# EAGLE schematic vcan_v5 (EAGLE 9.7.0)
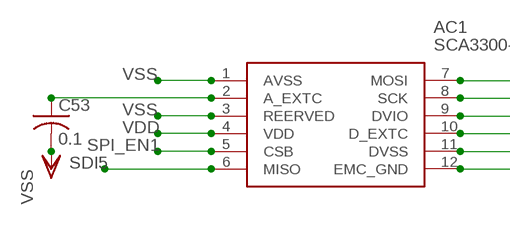
[diagram p0: schematic, sheet 1, part 1 of 2]
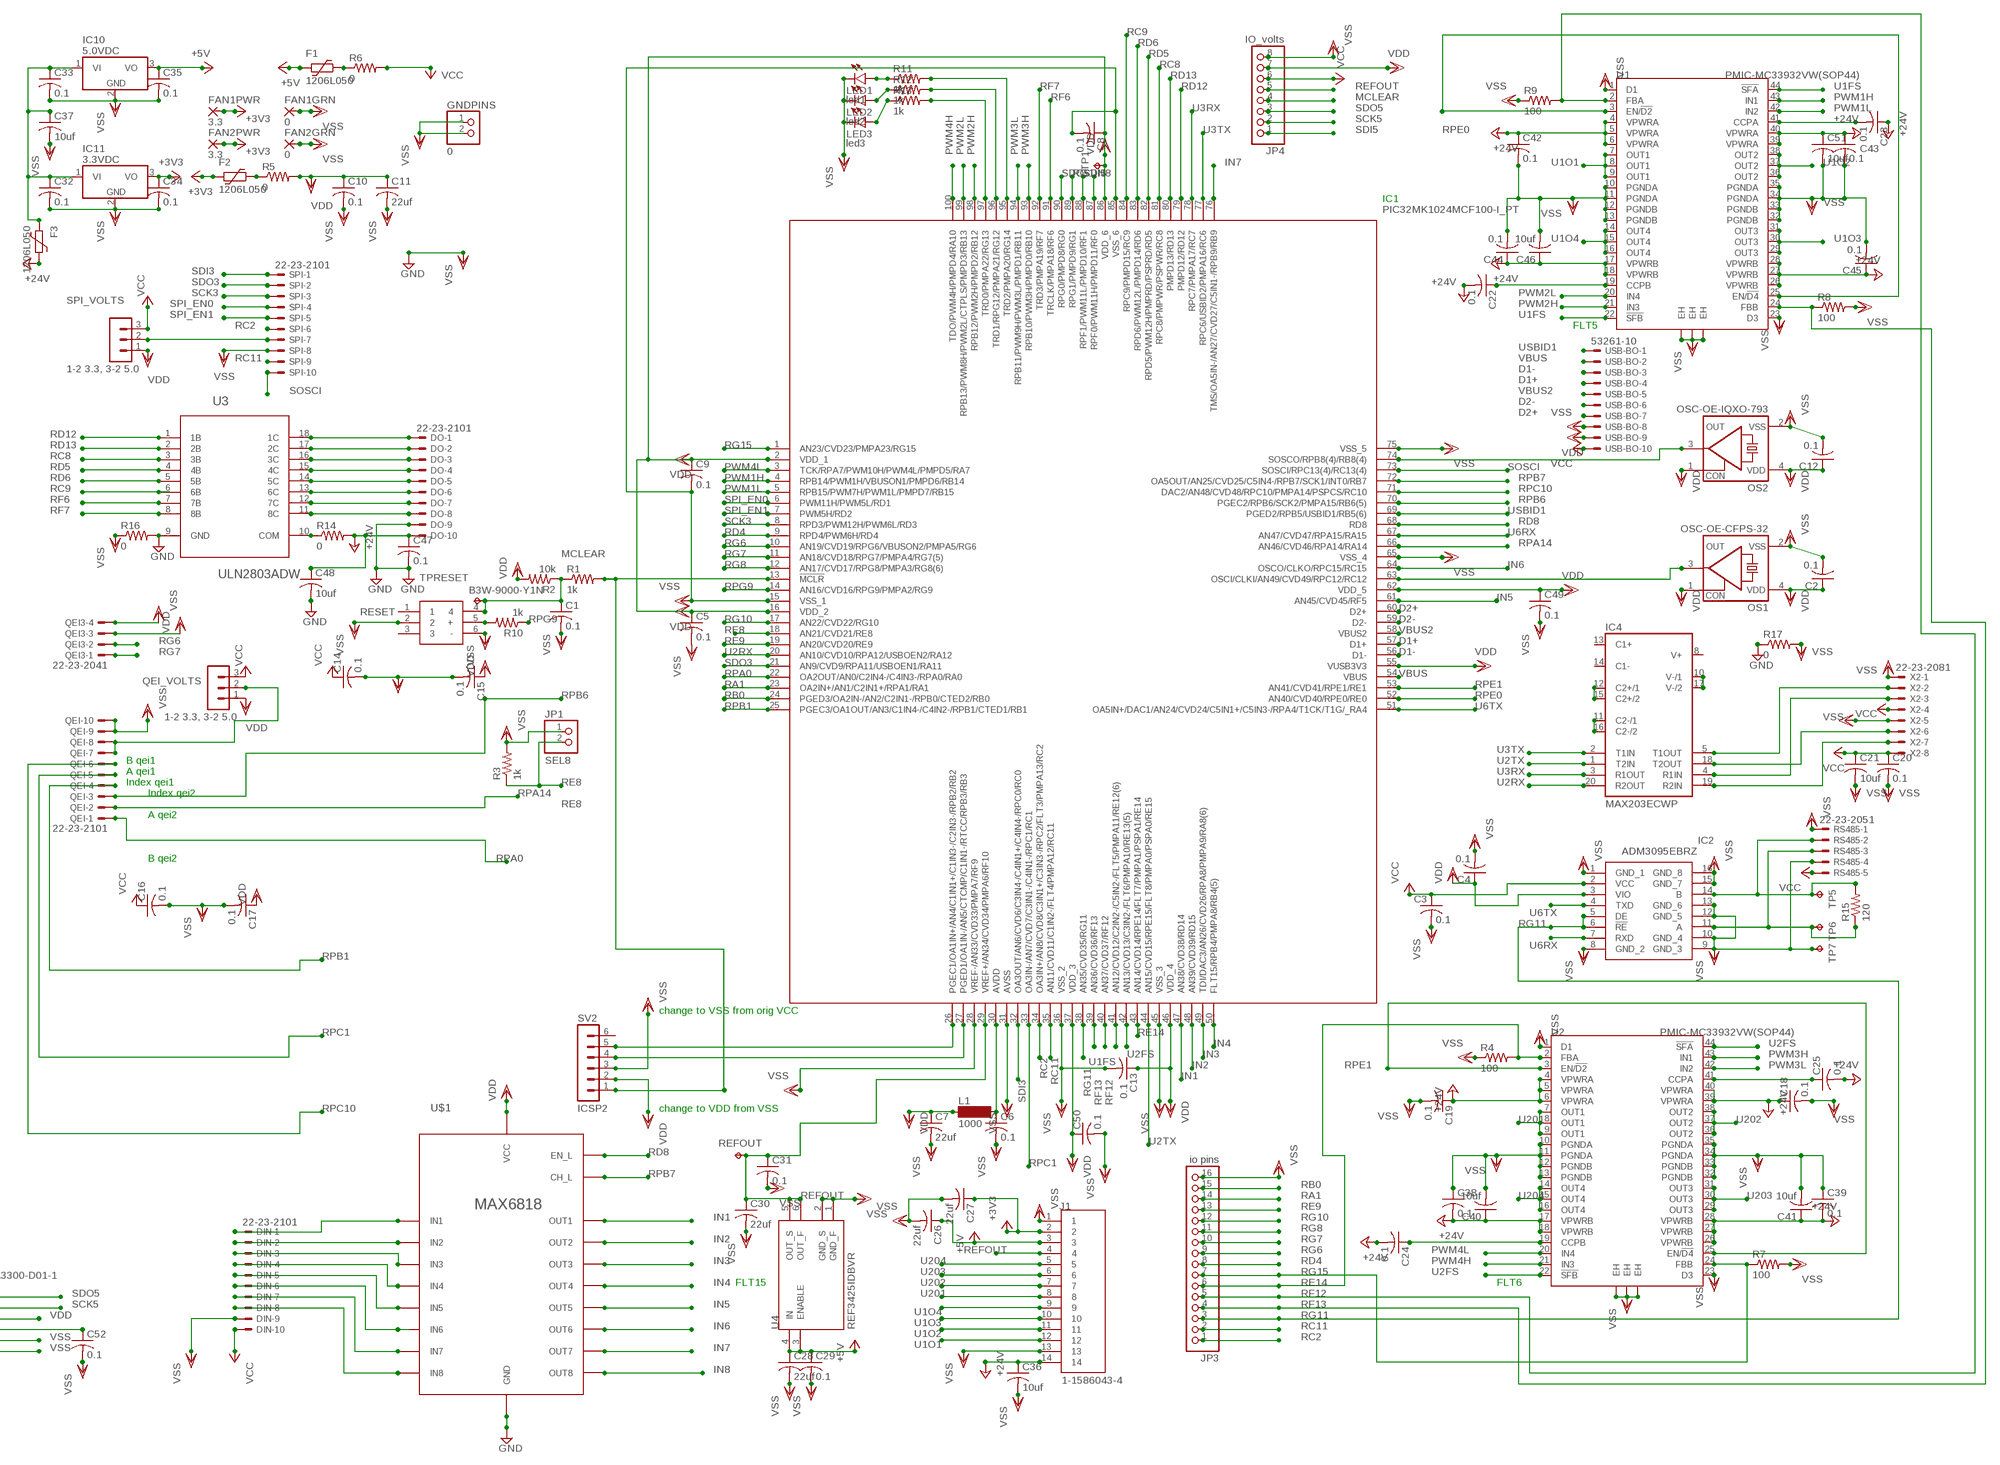
[diagram p1: schematic, sheet 1, part 2 of 2]

## Parts
AC1  SCA3300-D01-1  [SCA3300]
C1  0.1  C-USC0805  [C0805]
C2  0.1  C-USC0805  [C0805]
C3  0.1  C-USC0805  [C0805]
C4  0.1  C-USC0805  [C0805]
C5  0.1  C-USC0805  [C0805]
C6  0.1  C-USC0805  [C0805]
C7  22uf  C-USC0805  [C0805]
C8  0.1  C-USC0805  [C0805]
C9  0.1  C-USC0805  [C0805]
C10  0.1  C-USC0805  [C0805]
C11  22uf  C-USC0805  [C0805]
C12  0.1  C-USC0805  [C0805]
C13  0.1  C-USC0805  [C0805]
C14  0.1  C-USC0805  [C0805]
C15  0.1  C-USC0805  [C0805]
C16  0.1  C-USC0805  [C0805]
C17  0.1  C-USC0805  [C0805]
C18  0.1  C-USC0805  [C0805]
C19  0.1  C-USC0805  [C0805]
C20  0.1  C-USC0805  [C0805]
C21  10uf  C-USC1206  [C1206]
C22  0.1  C-USC0805  [C0805]
C23  0.1  C-USC0805  [C0805]
C24  0.1  C-USC0805  [C0805]
C25  0.1  C-USC0805  [C0805]
C26  22uf  C-USC0805  [C0805]
C27  22uf  C-USC0805  [C0805]
C28  22uf  C-USC0805  [C0805]
C29  0.1  C-USC0805  [C0805]
C30  22uf  C-USC0805  [C0805]
C31  0.1  C-USC0805  [C0805]
C32  0.1  C-USC0805  [C0805]
C33  0.1  C-USC0805  [C0805]
C34  0.1  C-USC0805  [C0805]
C35  0.1  C-USC0805  [C0805]
C36  10uf  C-USC1206  [C1206]
C37  10uf  C-USC1206  [C1206]
C38  0.1  C-USC0805  [C0805]
C39  0.1  C-USC0805  [C0805]
C40  10uf  C-USC1206  [C1206]
C41  10uf  C-USC1206  [C1206]
C42  0.1  C-USC0805  [C0805]
C43  0.1  C-USC0805  [C0805]
C44  0.1  C-USC0805  [C0805]
C45  0.1  C-USC0805  [C0805]
C46  10uf  C-USC1206  [C1206]
C47  0.1  C-USC0805  [C0805]
C48  10uf  C-USC1206  [C1206]
C49  0.1  C-USC0805  [C0805]
C50  0.1  C-USC0805  [C0805]
C51  10uf  C-USC1206  [C1206]
C52  0.1  C-USC0805  [C0805]
C53  0.1  C-USC0805  [C0805]
DIN  22-23-2101  [22-23-2101]
DO  22-23-2101  [22-23-2101]
F1  1206L050  [1206L]
F2  1206L050  [1206L]
F3  1206L050  [1206L]
FAN1GRN  0  1,6/0,8  [1,6/0,8]
FAN1PWR  3.3  1,6/0,8  [1,6/0,8]
FAN2GRN  0  1,6/0,8  [1,6/0,8]
FAN2PWR  3.3  1,6/0,8  [1,6/0,8]
GNDPINS  0  PINHD-1X2  [1X02]
IC1  PIC32MK1024MCF100-I_PT  [QFP40P1400X1400X120-100N]
IC2  ADM3095EBRZ  [SOIC127P600X175-16N]
IC4  MAX203ECWP  [SO20L]
IC10  5.0VDC  7805T  [TO220H]
IC11  3.3VDC  7805T  [TO220H]
J1  1-1586043-4  [TE_1-1586043-4]
JP1  SEL8  PINHD-1X2  [1X02]
JP3  io pins  PINHD-1X16  [1X16]
JP4  IO_volts  PINHD-1X8  [1X08]
L1  1000  SM-1206  [SM-1206]
LED1  led1  LEDCHIPLED_1206  [CHIPLED_1206]
LED2  led2  LEDCHIPLED_1206  [CHIPLED_1206]
LED3  led3  LEDCHIPLED_1206  [CHIPLED_1206]
OS1  OSC-OE-CFPS-32  [7.2X5.2-4-PAD]
OS2  OSC-OE-IQXO-793  [2.5X2-4-PAD]
QEI  22-23-2101  [22-23-2101]
QEI3  22-23-2041  [22-23-2041]
QEI_VOLTS  1-2 3.3, 3-2 5.0  MA03-1  [MA03-1]
R1  1k  R-US_M0805  [M0805]
R2  10k  R-US_M0805  [M0805]
R3  1k  R-US_M0805  [M0805]
R4  100  R-US_R0805  [R0805]
R5  0  R-US_M0805  [M0805]
R6  0  R-US_M0805  [M0805]
R7  100  R-US_R0805  [R0805]
R8  100  R-US_R0805  [R0805]
R9  100  R-US_R0805  [R0805]
R10  1k  R-US_M0805  [M0805]
R11  1k  R-US_M0805  [M0805]
R12  1k  R-US_M0805  [M0805]
R13  1k  R-US_M0805  [M0805]
R14  0  R-US_M0805  [M0805]
R15  120  R-US_R0805  [R0805]
R16  0  R-US_M0805  [M0805]
R17  0  R-US_M0805  [M0805]
REFOUT  TPB1,27  [B1,27]
RESET  B3W-9000-Y1N  [B3W-9_1-LED]
RS485  22-23-2051  [22-23-2051]
SPI  22-23-2101  [22-23-2101]
SPI_VOLTS  1-2 3.3, 3-2 5.0  MA03-1  [MA03-1]
SV2  ICSP2  MA06-1  [MA06-1]
TP1  TPB1,27  [B1,27]
TP5  TPB1,27  [B1,27]
TP6  TPB1,27  [B1,27]
TP7  TPB1,27  [B1,27]
TPRESET  TPB1,27  [B1,27]
U1  PMIC-MC33932VW(SOP44)  [SOP44-0.65-15.8X10.9MM]
U2  PMIC-MC33932VW(SOP44)  [SOP44-0.65-15.8X10.9MM]
U3  ULN2803ADW  [SOIC127P1030X265-18N]
U4  REF3425IDBVR  REF3440IDBVR  [SOT95P280X145-6N]
U$1  MAX6818  [SSOP20]
USB-BO  53261-10  [53261-10]
X2  22-23-2081  [22-23-2081]

## Nets
+3V3 [icurrent]: C27.1 C34.1 F2.2 FAN1PWR.1(P) FAN2PWR.1(P) IC11.3(VO) J1.2
+5V [icurrent]: C26.1 C28.1 C29.1 C35.1 F1.2 IC10.3(VO) J1.3 U4.3(ENABLE) U4.4(IN)
+24V [mcurrent]: C18.1 C19.1 C22.2 C23.1 C24.2 C25.2 C36.1 C38.2 C39.2 C40.1 C41.1 C42.1 C43.1 C44.1 C45.1 C46.1 C47.1 C48.1 C51.1 DO.10 F3.1 J1.14 R14.2 U1.4(VPWRA) U1.5(VPWRA) U1.6(VPWRA) U1.17(VPWRB) U1.18(VPWRB) U1.26(VPWRB) U1.27(VPWRB) U1.28(VPWRB) U1.39(VPWRA) U1.40(VPWRA) U2.4(VPWRA) U2.5(VPWRA) U2.6(VPWRA) U2.17(VPWRB) U2.18(VPWRB) U2.26(VPWRB) U2.27(VPWRB) U2.28(VPWRB) U2.39(VPWRA) U2.40(VPWRA)
D1+: IC1.57(D1+) USB-BO.4
D1-: IC1.56(D1-) USB-BO.3
D2+: IC1.60(D2+) USB-BO.7
D2-: IC1.59(D2-) USB-BO.6
DO1 [mcurrent]: DO.1 U3.18(1C)
DO2 [mcurrent]: DO.2 U3.17(2C)
DO3 [mcurrent]: DO.3 U3.16(3C)
DO4 [mcurrent]: DO.4 U3.15(4C)
DO5 [mcurrent]: DO.5 U3.14(5C)
DO6 [mcurrent]: DO.6 U3.13(6C)
DO7 [mcurrent]: DO.7 U3.12(7C)
DO8 [mcurrent]: DO.8 U3.11(8C)
GND [icurrent]: C47.2 C48.2 DO.9 R16.2 R17.1 U3.9(GND) U$1.GND ; supply symbol labelled VSS
IN1: IC1.47(AN38/CVD38/RD14) U$1.OUT1
IN2: IC1.48(AN39/CVD39/RD15) U$1.OUT2
IN3: IC1.49(TDI/DAC3/AN26/CVD26/RPA8/PMPA9/RA8(6)) U$1.OUT3
IN4: IC1.50(FLT15/RPB4/PMPA8/RB4(5)) U$1.OUT4
IN5: IC1.61(AN45/CVD45/RF5) U$1.OUT5
IN6: IC1.64(OSCO/CLKO/RPC15/RC15) U$1.OUT6
IN7: IC1.76(TMS/OA5IN-/AN27/CVD27/C5IN1-/RPB9/RB9) U$1.OUT7
IN8: IC1.87(RPF0/PWM11H/PMPD11/RF0) U$1.OUT8
MCLEAR: C1.1 JP4.4 R1.1 R2.1 RESET.4 TPRESET.TP
N$1: IC1.74(SOSCO/RPB8(4)/RB8(4)) OS2.3(OUT)
N$2: IC1.13(!MCLR) R1.2 SV2.1
N$3: F2.1 R5.1
N$4: DIN.1 U$1.IN1
N$6: C6.1 IC1.30(AVDD) L1.2
N$7: IC1.63(OSCI/CLKI/AN49/CVD49/RPC12/RC12) OS1.3(OUT)
N$8: AC1.2(A_EXTC) C53.1
N$9: F1.1 R6.1
N$13: IC1.27(PGED1/OA1IN-/AN5/CTCMP/C1IN1-/RTCC/RPB3/RB3) SV2.4
N$14: IC1.26(PGEC1/OA1IN+/AN4/C1IN1+/C1IN3-/C2IN3-/RPB2/RB2) SV2.5
N$17: DIN.2 U$1.IN2
N$18: DIN.3 U$1.IN3
N$19: DIN.4 U$1.IN4
N$20: DIN.5 U$1.IN5
N$21: DIN.6 U$1.IN6
N$22: DIN.7 U$1.IN7
N$23: DIN.8 U$1.IN8
N$24: C22.1 U1.19(CCPB)
N$25: C23.2 U1.41(CCPA)
N$26: C24.1 U2.19(CCPB)
N$27: C25.1 U2.41(CCPA)
N$29: AC1.10(D_EXTC) C52.1
N$30 [mcurrent]: C32.1 C33.1 C37.1 F3.2 IC10.1(VI) IC11.1(VI)
N$32: R10.2 RESET.5(+)
N$33: IC1.95(TRD2/PMPA20/RG14) R11.2
N$34: IC1.96(TRD1/RPG12/PMPA21/RG12) R12.2
N$35: IC1.97(TRD0/PMPA22/RG13) R13.2
N$36: LED1.A R11.1
N$37: LED2.A R12.1
N$38: LED3.A R13.1
N$39: IC2.14(B) R15.2 RS485.2 TP5.TP
N$40: IC2.11(A) R15.1 RS485.3 TP6.TP
N$41: IC4.10(V-/1) IC4.17(V-/2)
N$42: IC4.11(C2-/1) IC4.16(C2-/2)
N$43: IC4.12(C2+/1) IC4.15(C2+/2)
N$44: IC4.5(T1OUT) X2.2
N$45: IC4.4(R1IN) X2.3
N$54: R14.1 U3.10(COM)
N$55: IC4.18(T2OUT) X2.6
N$56: IC4.19(R2IN) X2.7
PWM1H: IC1.4(RPB14/PWM1H/VBUSON1/PMPD6/RB14) U1.43(IN1)
PWM1L: IC1.5(RPB15/PWM7H/PWM1L/PMPD7/RB15) U1.42(IN2)
PWM2H: IC1.98(RPB12/PWM2H/PMPD2/RB12) U1.21(IN3)
PWM2L: IC1.99(RPB13/PWM8H/PWM2L/CTPLS/PMPD3/RB13) U1.20(IN4)
PWM3H: IC1.93(RPB10/PWM3H/PMPD0/RB10) U2.43(IN1)
PWM3L: IC1.94(RPB11/PWM9H/PWM3L/PMPD1/RB11) U2.42(IN2)
PWM4H: IC1.100(TDO/PWM4H/PMPD4/RA10) U2.21(IN3)
PWM4L: IC1.3(TCK/RPA7/PWM10H/PWM4L/PMPD5/RA7) U2.20(IN4)
QEI_VOLTS [icurrent]: QEI.7 QEI.8 QEI_VOLTS.2
RA1: IC1.23(OA2IN+/AN1/C2IN1+/RPA1/RA1) JP3.14
RB0: IC1.24(PGED3/OA2IN-/AN2/C2IN1-/RPB0/CTED2/RB0) JP3.15
RC2: IC1.34(OA3IN+/AN8/CVD8/C3IN1+/C3IN3-/RPC2/FLT3/PMPA13/RC2) JP3.1 SPI.6
RC8: IC1.81(RPC8/PMPWR/PSPWR/RC8) U3.3(3B)
RC9: IC1.84(RPC9/PMPD15/RC9) U3.6(6B)
RC11: IC1.35(AN11/CVD11/C1IN2-/FLT4/PMPA12/RC11) JP3.2 SPI.9
RD4: IC1.9(RPD4/PWM6H/RD4) JP3.8
RD5: IC1.82(RPD5/PWM12H/PMPRD/PSPRD/RD5) U3.4(4B)
RD6: IC1.83(RPD6/PWM12L/PMPD14/RD6) U3.5(5B)
RD8: IC1.68(RD8) U$1.EN_L
RD12: IC1.79(PMPD12/RD12) U3.1(1B)
RD13: IC1.80(PMPD13/RD13) U3.2(2B)
RE8: IC1.18(AN21/CVD21/RE8) JP1.2 R3.1
RE9: IC1.19(AN20/CVD20/RE9) JP3.13
RE14: IC1.43(AN14/CVD14/RPE14/FLT7/PMPA1/PSPA1/RE14) JP3.6 R4.2 U2.2(FBA)
REFOUT: C30.1 C31.1 IC1.29(VREF+/AN34/CVD34/PMPA6/RF10) J1.4 JP4.5 REFOUT.TP U4.5(OUT_S) U4.6(OUT_F)
RF6: IC1.91(TRCLK/PMPA18/RF6) U3.7(7B)
RF7: IC1.92(TRD3/PMPA19/RF7) U3.8(8B)
RF12: IC1.40(AN37/CVD37/RF12) JP3.5 R9.2 U1.2(FBA)
RF13: IC1.39(AN36/CVD36/RF13) JP3.4 R8.1 U1.24(FBB)
RG1: IC1.89(RPG1/PMPD9/RG1)
RG6: IC1.10(AN19/CVD19/RPG6/VBUSON2/PMPA5/RG6) JP3.9 QEI3.2
RG7: IC1.11(AN18/CVD18/RPG7/PMPA4/RG7(5)) JP3.10 QEI3.1
RG8: IC1.12(AN17/CVD17/RPG8/PMPA3/RG8(6)) JP3.11
RG10: IC1.17(AN22/CVD22/RG10) JP3.12
RG11: IC1.38(AN35/CVD35/RG11) IC2.5(DE) IC2.6(!RE) JP3.3
RG15: IC1.1(AN23/CVD23/PMPA23/RG15) JP3.7 R7.1 U2.24(FBB)
RPA0: IC1.22(OA2OUT/AN0/C2IN4-/C4IN3-/RPA0/RA0) QEI.1
RPA14: IC1.66(AN46/CVD46/RPA14/RA14) QEI.2
RPB1: IC1.25(PGEC3/OA1OUT/AN3/C1IN4-/C4IN2-/RPB1/CTED1/RB1) QEI.4
RPB6: IC1.70(PGEC2/RPB6/SCK2/PMPA15/RB6(5)) QEI.3
RPB7: IC1.72(OA5OUT/AN25/CVD25/C5IN4-/RPB7/SCK1/INT0/RB7) U$1.CH_L
RPC1: IC1.33(OA3IN-/AN7/CVD7/C3IN1-/C4IN1-/RPC1/RC1) QEI.5
RPC10: IC1.71(DAC2/AN48/CVD48/RPC10/PMPA14/PSPCS/RC10) QEI.6
RPE0: IC1.52(AN40/CVD40/RPE0/RE0) U1.3(EN/!D2) U1.25(EN/!D4)
RPE1: IC1.53(AN41/CVD41/RPE1/RE1) U2.3(EN/!D2) U2.25(EN/!D4)
RPG9: IC1.14(AN16/CVD16/RPG9/PMPA2/RG9) R10.1
SCK3: IC1.8(RPD3/PWM12H/PWM6L/RD3) SPI.3
SCK5: AC1.8(SCK) JP4.2
SDI3: IC1.32(OA3OUT/AN6/CVD6/C3IN4-/C4IN1+/C4IN4-/RPC0/RC0) SPI.1
SDI5: AC1.6(MISO) IC1.88(RPF1/PWM11L/PMPD10/RF1) JP4.1
SDO3: IC1.21(AN9/CVD9/RPA11/USBOEN1/RA11) SPI.2
SDO5: AC1.7(MOSI) IC1.90(RPG0/PMPD8/RG0) JP4.3
SOSCI: IC1.73(SOSCI/RPC13(4)/RC13(4)) SPI.10
SPI_EN0: IC1.6(PWM11H/PWM5L/RD1) SPI.4
SPI_EN1: AC1.5(CSB) IC1.7(PWM5H/RD2) SPI.5
SPIVOLTS [icurrent]: SPI.7 SPI_VOLTS.2
U1FS: IC1.41(AN12/CVD12/C2IN2-/C5IN2-/FLT5/PMPA11/RE12(6)) U1.22(!SFB) U1.44(!SFA)
U1O1 [mcurrent]: J1.12 U1.7(OUT1) U1.8(OUT1) U1.9(OUT1)
U1O2 [mcurrent]: J1.11 U1.36(OUT2) U1.37(OUT2) U1.38(OUT2)
U1O3 [mcurrent]: J1.10 U1.29(OUT3) U1.30(OUT3) U1.31(OUT3)
U1O4 [mcurrent]: J1.9 U1.14(OUT4) U1.15(OUT4) U1.16(OUT4)
U2FS: IC1.42(AN13/CVD13/C3IN2-/FLT6/PMPA10/RE13(5)) U2.22(!SFB) U2.44(!SFA)
U2RX: IC1.20(AN10/CVD10/RPA12/USBOEN2/RA12) IC4.20(R2OUT)
U2TX: IC1.44(AN15/CVD15/RPE15/FLT8/PMPA0/PSPA0/RE15) IC4.1(T2IN)
U3RX: IC1.78(RPC7/PMPA17/RC7) IC4.3(R1OUT)
U3TX: IC1.77(RPC6/USBID2/PMPA16/RC6) IC4.2(T1IN)
U6RX: IC1.67(AN47/CVD47/RPA15/RA15) IC2.7(RXD)
U6TX: IC1.51(OA5IN+/DAC1/AN24/CVD24/C5IN1+/C5IN3-/RPA4/T1CK/T1G/_RA4) IC2.4(TXD)
U201 [mcurrent]: J1.8 U2.7(OUT1) U2.8(OUT1) U2.9(OUT1)
U202 [mcurrent]: J1.7 U2.36(OUT2) U2.37(OUT2) U2.38(OUT2)
U203 [mcurrent]: J1.6 U2.29(OUT3) U2.30(OUT3) U2.31(OUT3)
U204 [mcurrent]: J1.5 U2.14(OUT4) U2.15(OUT4) U2.16(OUT4)
USBID1: IC1.69(PGED2/RPB5/USBID1/RB5(6)) USB-BO.1
VBUS: IC1.54(VBUS) USB-BO.2
VBUS2: IC1.58(VBUS2) USB-BO.5
VCC [icurrent]: C3.1 C14.1 C16.1 C20.1 C21.1 DIN.10 IC2.2(VCC) JP4.6 QEI_VOLTS.3 R6.2 RS485.5 SPI_VOLTS.3 USB-BO.10 X2.4 X2.8
VDD [icurrent]: AC1.4(VDD) AC1.9(DVIO) C2.1 C4.1 C5.1 C7.1 C8.1 C9.1 C10.1 C11.1 C12.1 C13.1 C15.1 C17.1 C49.1 C50.1 IC1.2(VDD_1) IC1.16(VDD_2) IC1.37(VDD_3) IC1.46(VDD_4) IC1.55(VUSB3V3) IC1.62(VDD_5) IC1.86(VDD_6) IC2.3(VIO) JP4.7 L1.1 OS1.1(CON) OS1.4(VDD) OS2.1(CON) OS2.4(VDD) QEI3.3 QEI_VOLTS.1 R2.2 R5.2 SPI_VOLTS.1 SV2.2 TP1.TP U$1.VCC USB-BO.9
VSS [icurrent]: AC1.1(AVSS) AC1.3(REERVED) AC1.11(DVSS) AC1.12(EMC_GND) C1.2 C2.2 C3.2 C4.2 C5.2 C6.2 C7.2 C8.2 C9.2 C10.2 C11.2 C12.2 C13.2 C14.2 C15.2 C16.2 C17.2 C18.2 C19.2 C20.2 C21.2 C26.2 C27.2 C28.2 C29.2 C30.2 C31.2 C32.2 C33.2 C34.2 C35.2 C36.2 C37.2 C38.1 C39.1 C40.2 C41.2 C42.2 C43.2 C44.2 C45.2 C46.2 C49.2 C50.2 C51.2 C52.2 C53.2 DIN.9 FAN1GRN.1(P) FAN2GRN.1(P) GNDPINS.1 GNDPINS.2 IC1.15(VSS_1) IC1.28(VREF-/AN33/CVD33/PMPA7/RF9) IC1.31(AVSS) IC1.36(VSS_2) IC1.45(VSS_3) IC1.65(VSS_4) IC1.75(VSS_5) IC1.85(VSS_6) IC2.1(GND_1) IC2.8(GND_2) IC2.9(GND_3) IC2.10(GND_4) IC2.12(GND_5) IC2.13(GND_6) IC2.15(GND_7) IC2.16(GND_8) IC10.2(GND) IC11.2(GND) J1.1 J1.13 JP1.1 JP3.16 JP4.8 LED1.C LED2.C LED3.C OS1.2(VSS) OS2.2(VSS) QEI3.4 QEI.9 QEI.10 R3.2 R4.1 R7.2 R8.2 R9.1 R16.1 R17.2 RESET.2 RESET.6(-) RS485.1 RS485.4 SPI.8 SV2.3 TP7.TP U1.1(D1) U1.10(PGNDA) U1.11(PGNDA) U1.12(PGNDB) U1.13(PGNDB) U1.23(D3) U1.32(PGNDB) U1.33(PGNDB) U1.34(PGNDA) U1.35(PGNDA) U1.EH@1(EH) U1.EH@2(EH) U1.EH@3(EH) U2.1(D1) U2.10(PGNDA) U2.11(PGNDA) U2.12(PGNDB) U2.13(PGNDB) U2.23(D3) U2.32(PGNDB) U2.33(PGNDB) U2.34(PGNDA) U2.35(PGNDA) U2.EH@1(EH) U2.EH@2(EH) U2.EH@3(EH) U4.1(GND_F) U4.2(GND_S) USB-BO.8 X2.1 X2.5
Unconnected: IC4.8(V+) IC4.13(C1+) IC4.14(C1-) RESET.1 RESET.3 SV2.6

## Notes on the sheet
- FLT5
- B qei1
- A qei1
- Index qei1
- Index qei2
- A qei2
- B qei2
- change to VSS from orig VCC
- change to VDD from VSS
- FLT15 | FLT6

## Power pins joined to a net without a drawn wire
GND: IC4.6(GND) IC4.9(GND)
VCC: IC4.7(VCC)

## Library data of the parts
AC1 = SCA3300-D01-1:SCA3300-D01-1: Murata SCA3300-D01-1, 3-Axis Accelerometer, +/-1.5 +/-6g, 3 3.6 V, SPI, DFL/SMD 12-Pin Source: Datasheet <https://www.murata.com/~/media/webrenewal/products/sensor/accel/sca3300/sca3300-d01 industrial 3-axis accelerometer datasheet _a1.ashx> Check availability <https://pricing.snapeda.com/parts/SCA3300-D01-1/Murata%20Electronics/view-part?ref=eda>; AVAILABILITY: In Stock; DESCRIPTION: Accelerometer X, Y, Z Axis ±1.5g, 3g, 6g - -; MF: Murata Electronics; MP: SCA3300-D01-1; PACKAGE: Nonstandard Murata; PRICE: None; PURCHASE-URL: https://pricing.snapeda.com/search/part/SCA3300-D01-1/?ref=eda
C1-C53 = rcl:C-US: CAPACITOR, American symbol; SPICEPREFIX: C
DIN DO QEI SPI = con-molex:22-23-2101: .100" (2.54mm) Center Header - 10 Pin; MF: MOLEX; MPN: 22-23-2101; OC_FARNELL: 1756828; OC_NEWARK: 94C0765
F1-F3 = polyfuse-smd_10:?: Polyfuse Resettable PTC Source: http://www.littelfuse.com/products/resettable-ptcs.aspx; MF: Littelfuse; MPN: 1206L050; OC_FARNELL: 1596993; OC_NEWARK: 53M6118
FAN1GRN FAN1PWR FAN2GRN FAN2PWR = wirepad:1,6/0,8: THROUGH-HOLE PAD
GNDPINS JP1 = pinhead:PINHD-1X2: PIN HEADER
IC1 = PIC32MK1024MCF100-I_PT:PIC32MK1024MCF100-I_PT: Microchip Technology MCU32, 120MHz, 4 I2C, 6 I2S, USB FS, CAN 2.0B, 12-bit ADC, Motor Control Source: Datasheet <http://ww1.microchip.com/downloads/en/DeviceDoc/60001402D.pdf>; DESCRIPTION: Microchip Technology MCU32, 120MHz, 4 I2C, 6 I2S, USB FS, CAN 2.0B, 12-bit ADC, Motor Control; HEIGHT: 1.2mm; MANUFACTURER_NAME: Microchip; MANUFACTURER_PART_NUMBER: PIC32MK1024MCF100-I/PT; MOUSER_PART_NUMBER: 579-2MK1024MCF100IPT; MOUSER_PRICE-STOCK: https://www.mouser.com/Search/Refine.aspx?Keyword=579-2MK1024MCF100IPT; RS_PART_NUMBER: 1449608P; RS_PRICE-STOCK: http://uk.rs-online.com/web/p/products/1449608P
IC2 = SamacSys_Parts:ADM3095EBRZ: Level 4 EMC Protected RS-485 Transceiver with Full +/-42 V Fault Protection Source: Datasheet <https://componentsearchengine.com/Datasheets/1/ADM3095EBRZ.pdf>; DESCRIPTION: Level 4 EMC Protected RS-485 Transceiver with Full +/-42 V Fault Protection; HEIGHT: 1.75mm; MANUFACTURER_NAME: Analog Devices; MANUFACTURER_PART_NUMBER: ADM3095EBRZ; MOUSER_PART_NUMBER: 584-ADM3095EBRZ; MOUSER_PRICE-STOCK: https://www.mouser.com/Search/Refine.aspx?Keyword=584-ADM3095EBRZ
IC4 = maxim:MAX203ECWP: RS232 TRANSCEIVER; MPN: MAX203ECWP+G36; OC_FARNELL: 1224204; OC_NEWARK: 89K3435
IC10 IC11 = linear:78*: Positive VOLTAGE REGULATOR Source: http://cache.national.com/ds/LM/LM78L05.pdf http://www.fairchildsemi.com/ds/LM/LM7805.pdf
J1 = 1-1586043-4:1-1586043-4; MANUFACTURER: TE; PARTREV: R; STANDARD: Manufacturer Recommendations
JP3 = pinhead:PINHD-1X16: PIN HEADER
JP4 = pinhead:PINHD-1X8: PIN HEADER
L1 = inductor-neosid:SM-1206: INDUCTOR SMD chip inductor; OC_FARNELL: unknown; OC_NEWARK: unknown
LED1-LED3 = led:LED: LED OSRAM: - CHIPLED LG R971, LG N971, LY N971, LG Q971, LY Q971, LO R971, LY R971 LH N974, LH R974 LS Q976, LO Q976, LY Q976 LO Q996 - Hyper CHIPLED LW Q18S LB Q993, LB Q99A, LB R99A - SideLED LS A670, LO A670, LY A670, LG A670, LP A670 LB A673, LV A673, LT A673, LW A673 LH A674 LY A675 LS A676, LA A676, LO A676, LY A676, LW A676 LS A679, LY A679, LG A679 - Hyper Micro SIDELED® LS Y876, LA Y876, LO Y876, LY Y876 LT Y87S - SmartLED LW L88C, LW L88S LB L89C, LB L89S, LG L890 LS L89K, LO L89K, LY L89K LS L896, LA L896, LO L896, LY L896 - TOPLED LS T670, LO T670, LY T670, LG T670, LP T670 LSG T670, LSP T670, LSY T670, LOP T670, LYG T670 LG T671, LOG T671, LSG T671 LB T673, LV T673, LT T673, LW T673 LH T674 LS T676, LA T676, LO T676, LY T676, LB T676, LH T676, LSB T676, LW T676 LB T67C, LV T67C, LT T67C, LS T67K, LO T67K, LY T67K, LW E67C LS E67B, LA E67B, LO E67B, LY E67B, LB E67C, LV E67C, LT E67C LW T67C LS T679, LY T679, LG T679 LS T770, LO T770, LY T770, LG T770, LP T770 LB T773, LV T773, LT T773, LW T773 LH T774 LS E675, LA E675, LY E675, LS T675 LS T776, LA T776, LO T776, LY T776, LB T776 LHGB T686 LT T68C, LB T68C - Hyper Mini TOPLED® LB M676 - Mini TOPLED Santana® LG M470 LS M47K, LO M47K, LY M47K Source: http://www.osram.convergy.de LUXEON: - LUMILED® LXK2-PW12-R00, LXK2-PW12-S00, LXK2-PW14-U00, LXK2-PW14-V00 LXK2-PM12-R00, LXK2-PM12-S00, LXK2-PM14-U00 LXK2-PE12-Q00, LXK2-PE12-R00, LXK2-PE12-S00, LXK2-PE14-T00, LXK2-PE14-U00 LXK2-PB12-K00, LXK2-PB12-L00, LXK2-PB12-M00, LXK2-PB14-N00, LXK2-PB14-P00, LXK2-PB14-Q00 LXK2-PR12-L00, LXK2-PR12-M00, LXK2-PR14-Q00, LXK2-PR14-R00 LXK2-PD12-Q00, LXK2-PD12-R00, LXK2-PD12-S00 LXK2-PH12-R00, LXK2-PH12-S00 LXK2-PL12-P00, LXK2-PL12-Q00, LXK2-PL12-R00 Source: www.luxeon.com KINGBRIGHT: KA-3528ASYC Source: www.kingbright.com
OS1 OS2 = IQD-Frequency-Products:OSC-OE: OSCILLATOR WITH OE
QEI3 = con-molex:22-23-2041: .100" (2.54mm) Center Header - 4 Pin; MF: MOLEX; MPN: 22-23-2041; OC_FARNELL: 1462920; OC_NEWARK: 38C0355
QEI_VOLTS SPI_VOLTS = con-lstb:MA03-1: PIN HEADER; OC_FARNELL: unknown; OC_NEWARK: unknown
R1-R17 = rcl:R-US_: RESISTOR, American symbol; SPICEPREFIX: R
REFOUT TP1 TP5-TP7 TPRESET = testpad:TP: Test pad
RESET = B3W-9000-Y1N:B3W-9000-Y1N: Illuminated Tactile Switches Illuminated Ylw LED White Cap Source: Datasheet <http://www.mouser.com/ds/2/307/en-b3w-9-11824.pdf>; ALLIED_NUMBER: 70176005; ALLIED_PRICE-STOCK: https://www.alliedelec.com/omron-electronic-components-b3w-9000-y1n/70176005/; DESCRIPTION: Illuminated Tactile Switches Illuminated Ylw LED White Cap; HEIGHT: mm; MANUFACTURER_NAME: Omron Electronics; MANUFACTURER_PART_NUMBER: B3W-9000-Y1N; MOUSER_PART_NUMBER: 653-B3W-9000-Y1N; MOUSER_PRICE-STOCK: https://www.mouser.com/Search/Refine.aspx?Keyword=653-B3W-9000-Y1N
RS485 = con-molex:22-23-2051: .100" (2.54mm) Center Header - 5 Pin; MF: MOLEX; MPN: 22-23-2051; OC_FARNELL: 1462952; OC_NEWARK: 38C9178
SV2 = con-lstb:MA06-1: PIN HEADER; OC_FARNELL: unknown; OC_NEWARK: unknown
U1 U2 = PMIC-MC33932VW_SOP44_:PMIC-MC33932VW(SOP44): 310030140; AVAILABILITY: Unavailable; DESCRIPTION: Motor Driver CMOS Parallel 44-HSOP; DIGIKEY-PURCHASE-URL: https://snapeda.com/shop?store=DigiKey&id=525358; MF: NXP USA; MP: MC33932VW; PACKAGE: HSOP-44 NXP Semiconductors; PRICE: None
U3 = maxim-10:ULN2803ADW: Darlington transistor array; AVAILABILITY: Unavailable; DESCRIPTION: Bipolar (BJT) Transistor Array 8 NPN Darlington 50V 500mA Surface Mount 18-SOIC; DIGIKEY-PURCHASE-URL: https://snapeda.com/shop?store=DigiKey&id=38030; MF: Texas Instruments; MP: ULN2803ADW; PACKAGE: SOIC-18 Texas Instruments; PRICE: None
U4 = REF3440IDBVR:REF3440IDBVR: 4.1V Low-Drift Low-Power Small-Footprint Series Voltage Reference 6-SOT-23 -40 to 125; AVAILABILITY: Unavailable; DESCRIPTION: Series Voltage Reference IC ±0.05% SOT-23-6; MF: Texas Instruments; MP: REF3440IDBVR; PACKAGE: SOT-23 Texas Instruments; PRICE: None
U$1 = MAX6818:MAX6818; AVAILABILITY: Unavailable; MF: Maxim Integrated; MP: MAX6818; PACKAGE: None; PRICE: None
USB-BO = con-molex:53?-10: CONNECTOR wire to board 1.25 mm (.049 inch) pitch header; MF: MOLEX; OC_FARNELL: unknown; OC_NEWARK: unknown
X2 = con-molex:22-23-2081: .100" (2.54mm) Center Header - 8 Pin; MF: MOLEX; MPN: 22-23-2081; OC_FARNELL: 1756826; OC_NEWARK: 01C7592

## Module RESET_M
Ports: 

### Library data of the parts

## Net classes
0 default: width 0.127 mm, drill 0.127 mm, clearance 0.127 mm
1 icurrent: width 0.178 mm
2 mcurrent: width 0.305 mm